# EAGLE design ESC-simple (EAGLE 8.5.2)
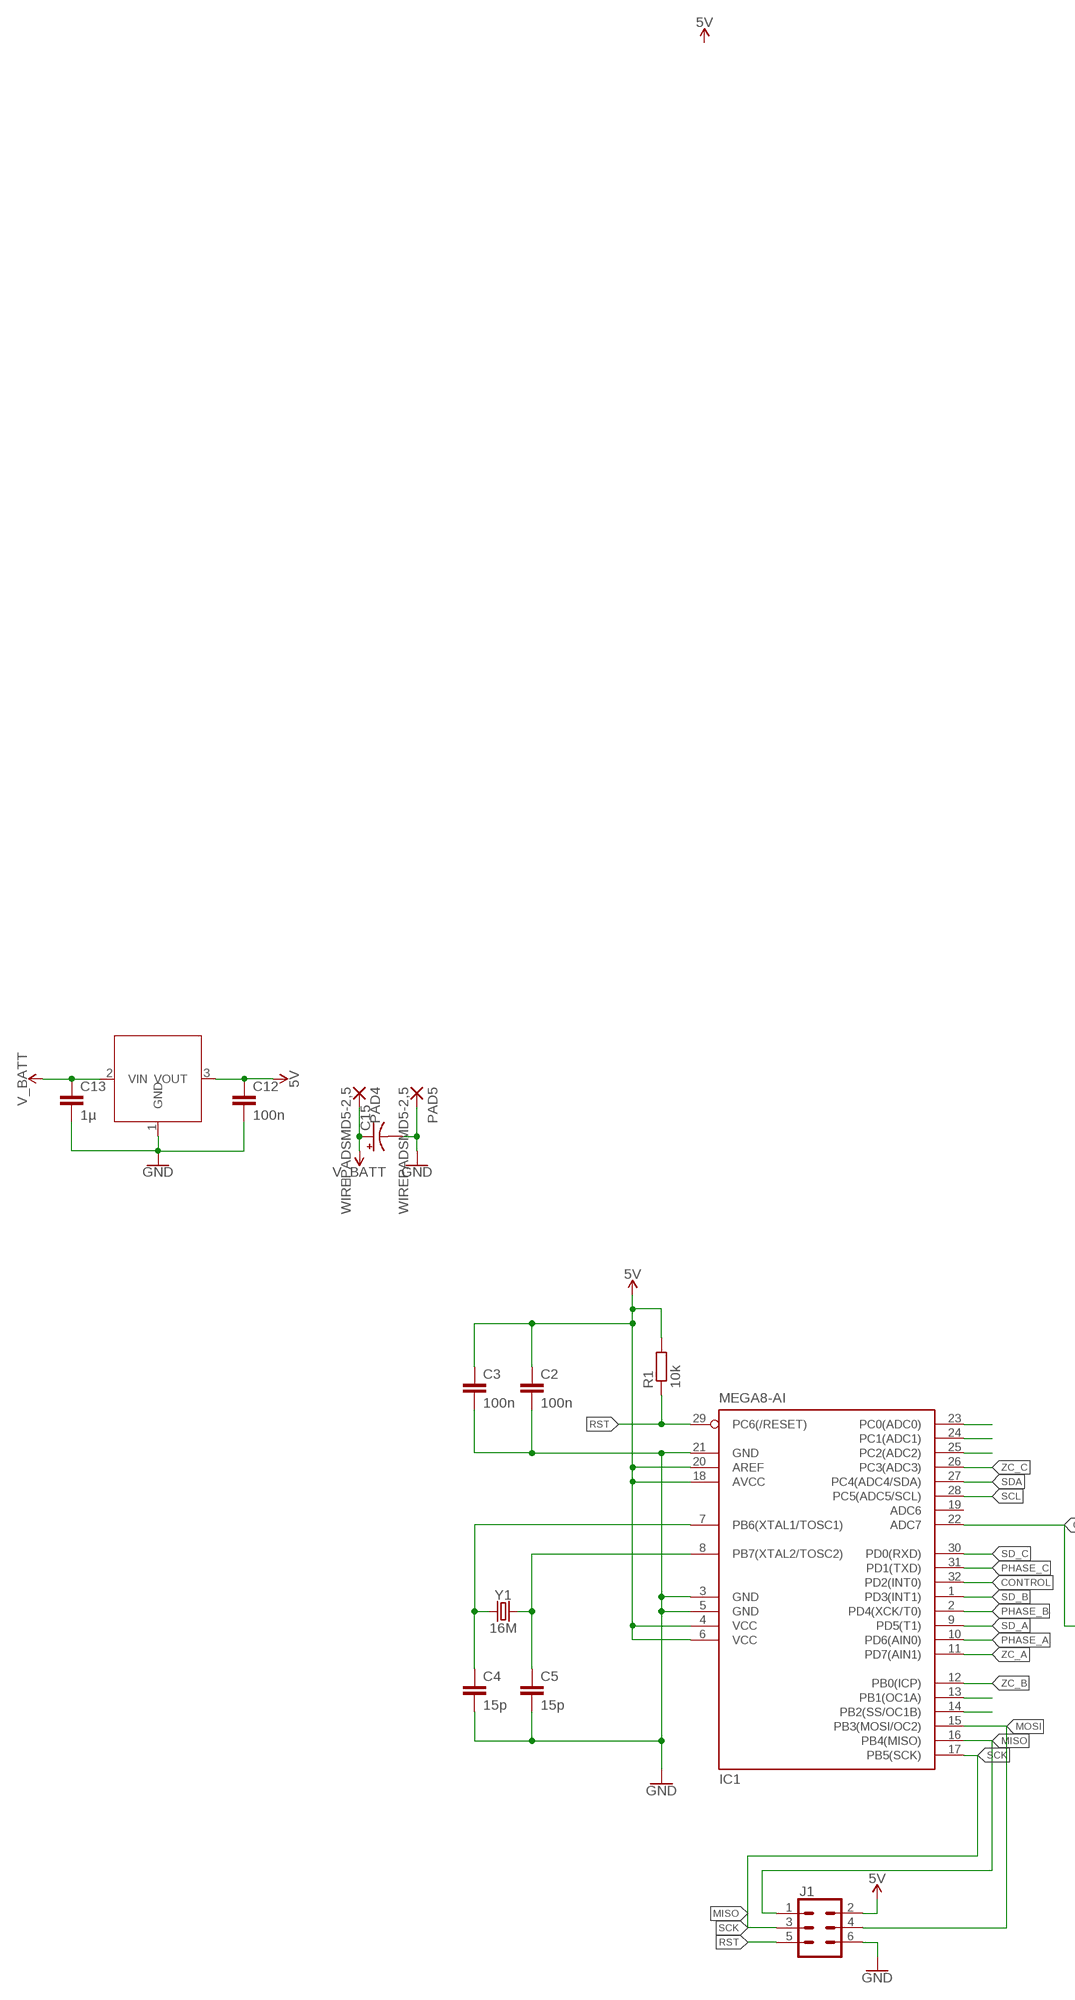
[diagram p0: schematic, sheet 1, part 1 of 2]
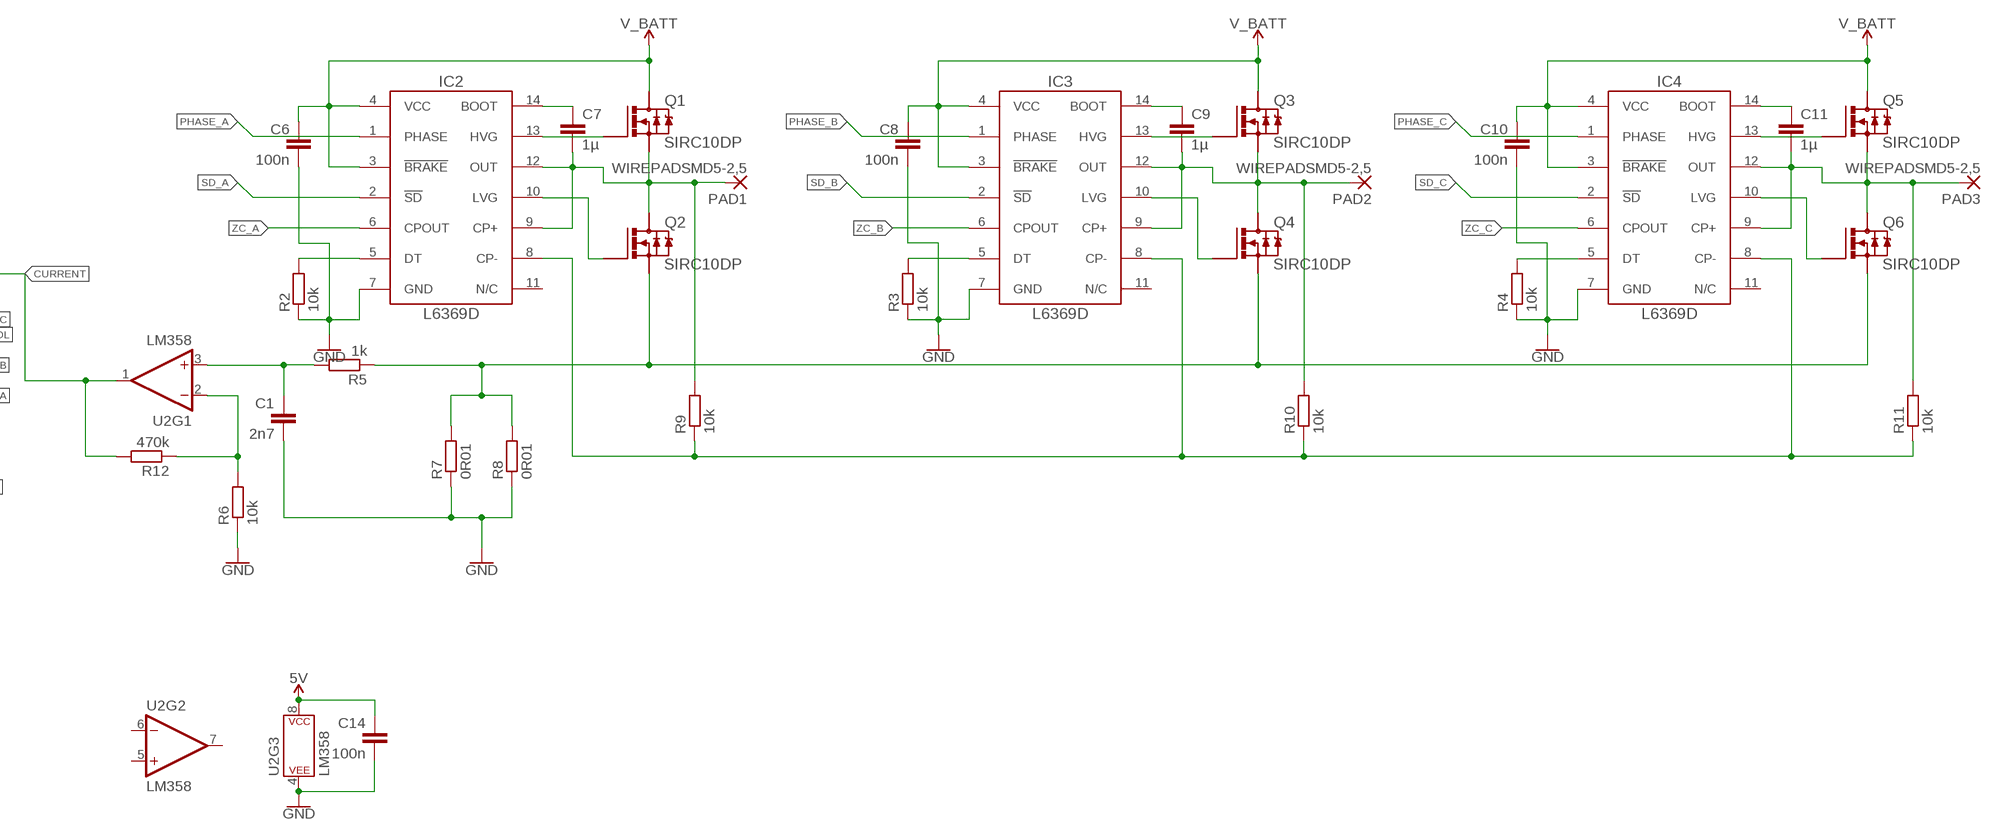
[diagram p1: schematic, sheet 1, part 2 of 2]

## Parts
C1  2n7  C-EUC1206K  [C1206K]
C2  100n  C-EUC1206K  [C1206K]
C3  100n  C-EUC1206K  [C1206K]
C4  15p  C-EUC1206K  [C1206K]
C5  15p  C-EUC1206K  [C1206K]
C6  100n  C-EUC1206K  [C1206K]
C7  1µ  C-EUC1206K  [C1206K]
C8  100n  C-EUC1206K  [C1206K]
C9  1µ  C-EUC1206K  [C1206K]
C10  100n  C-EUC1206K  [C1206K]
C11  1µ  C-EUC1206K  [C1206K]
C12  100n  C-EUC1206K  [C1206K]
C13  1µ  C-EUC1206K  [C1206K]
C14  100n  C-EUC1206K  [C1206K]
C15  CPOL-USE5-13  [E5-13]
IC1  MEGA8-AI  [TQFP32-08]
IC2  L6369D  [SO-14]
IC3  L6369D  [SO-14]
IC4  L6369D  [SO-14]
J1  CONN_03X22X3_SILK_MALE_PTH  [2X3]
PAD1  WIREPADSMD5-2,5  [5-2,5]
PAD2  WIREPADSMD5-2,5  [5-2,5]
PAD3  WIREPADSMD5-2,5  [5-2,5]
PAD4  WIREPADSMD5-2,5  [5-2,5]
PAD5  WIREPADSMD5-2,5  [5-2,5]
Q1  SIRC10DP  [POWERPAK_SO-8_SINGLE]
Q2  SIRC10DP  [POWERPAK_SO-8_SINGLE]
Q3  SIRC10DP  [POWERPAK_SO-8_SINGLE]
Q4  SIRC10DP  [POWERPAK_SO-8_SINGLE]
Q5  SIRC10DP  [POWERPAK_SO-8_SINGLE]
Q6  SIRC10DP  [POWERPAK_SO-8_SINGLE]
R1  10k  R-EU_R1206  [R1206]
R2  10k  R-EU_R1206  [R1206]
R3  10k  R-EU_R1206  [R1206]
R4  10k  R-EU_R1206  [R1206]
R5  1k  R-EU_R1206  [R1206]
R6  10k  R-EU_R1206  [R1206]
R7  0R01  R-EU_R1206  [R1206]
R8  0R01  R-EU_R1206  [R1206]
R9  10k  R-EU_R1206  [R1206]
R10  10k  R-EU_R1206  [R1206]
R11  10k  R-EU_R1206  [R1206]
R12  470k  R-EU_R1206  [R1206]
U2  LM358  [DIP08]
U$1  S812  [TO92L]
Y1  16M  CRYSTALSMD-HC49UP  [HC49UP]

## Nets
5V [power]: C2.1 C3.1 C12.1 C14.1 IC1.4(VCC) IC1.6(VCC) IC1.18(AVCC) IC1.20(AREF) J1.2 R1.2 U2.8(P$V+) U$1.3(VOUT)
A: C7.2 IC2.9(CP+) IC2.12(OUT) PAD1.1(P) Q1.1(S) Q1.2(S) Q1.3(S) Q2.5(D) Q2.6(D) Q2.7(D) Q2.8(D) Q2.9(D) R9.2
B: C9.2 IC3.9(CP+) IC3.12(OUT) PAD2.1(P) Q3.1(S) Q3.2(S) Q3.3(S) Q4.5(D) Q4.6(D) Q4.7(D) Q4.8(D) Q4.9(D) R10.2
C: C11.2 IC4.9(CP+) IC4.12(OUT) PAD3.1(P) Q5.1(S) Q5.2(S) Q5.3(S) Q6.5(D) Q6.6(D) Q6.7(D) Q6.8(D) Q6.9(D) R11.2
CONTROL: IC1.32(PD2(INT0))
CURRENT: IC1.22(ADC7) R12.2 U2.1(OUT)
CURRENT_SENSE: Q2.1(S) Q2.2(S) Q2.3(S) Q4.1(S) Q4.2(S) Q4.3(S) Q6.1(S) Q6.2(S) Q6.3(S) R5.1 R7.2 R8.2
GND: C1.2 C2.2 C3.2 C4.2 C5.2 C6.2 C8.2 C10.2 C12.2 C13.2 C14.2 C15.- IC1.3(GND) IC1.5(GND) IC1.21(GND) IC2.7(GND) IC3.7(GND) IC4.7(GND) J1.6 PAD5.1(P) R2.1 R3.1 R4.1 R6.1 R7.1 R8.1 U2.4(P$V-) U$1.1(GND)
MISO: IC1.16(PB4(MISO)) J1.1
MOSI: IC1.15(PB3(MOSI/OC2)) J1.4
N$1: C7.1 IC2.14(BOOT)
N$2: IC2.13(HVG) Q1.4(G)
N$3: IC2.10(LVG) Q2.4(G)
N$4: IC3.5(DT) R3.2
N$5: IC2.5(DT) R2.2
N$6: C9.1 IC3.14(BOOT)
N$7: IC3.13(HVG) Q3.4(G)
N$8: IC3.10(LVG) Q4.4(G)
N$9: R6.2 R12.1 U2.2(-IN)
N$10: IC4.5(DT) R4.2
N$11: C11.1 IC4.14(BOOT)
N$12: IC4.13(HVG) Q5.4(G)
N$13: IC4.10(LVG) Q6.4(G)
N$20: C1.1 R5.2 U2.3(+IN)
PB1: IC1.13(PB1(OC1A))
PB2: IC1.14(PB2(SS/OC1B))
PC0: IC1.23(PC0(ADC0))
PC1: IC1.24(PC1(ADC1))
PC2: IC1.25(PC2(ADC2))
PHASE_A: IC1.10(PD6(AIN0)) IC2.1(PHASE)
PHASE_B: IC1.2(PD4(XCK/T0)) IC3.1(PHASE)
PHASE_C: IC1.31(PD1(TXD)) IC4.1(PHASE)
RST: IC1.29(PC6(/RESET)) J1.5 R1.1
SCK: IC1.17(PB5(SCK)) J1.3
SCL: IC1.28(PC5(ADC5/SCL))
SD_A: IC1.9(PD5(T1)) IC2.2(!SD)
SD_B: IC1.1(PD3(INT1)) IC3.2(!SD)
SD_C: IC1.30(PD0(RXD)) IC4.2(!SD)
SDA: IC1.27(PC4(ADC4/SDA))
V_BATT [power]: C6.1 C8.1 C10.1 C13.1 C15.+ IC2.3(!BRAKE) IC2.4(VCC) IC3.3(!BRAKE) IC3.4(VCC) IC4.3(!BRAKE) IC4.4(VCC) PAD4.1(P) Q1.5(D) Q1.6(D) Q1.7(D) Q1.8(D) Q1.9(D) Q3.5(D) Q3.6(D) Q3.7(D) Q3.8(D) Q3.9(D) Q5.5(D) Q5.6(D) Q5.7(D) Q5.8(D) Q5.9(D) U$1.2(VIN)
V_NEUTRAL: IC2.8(CP-) IC3.8(CP-) IC4.8(CP-) R9.1 R10.1 R11.1
XTAL1: C4.1 IC1.7(PB6(XTAL1/TOSC1)) Y1.1
XTAL2: C5.1 IC1.8(PB7(XTAL2/TOSC2)) Y1.2
ZC_A: IC1.11(PD7(AIN1)) IC2.6(CPOUT)
ZC_B: IC1.12(PB0(ICP)) IC3.6(CPOUT)
ZC_C: IC1.26(PC3(ADC3)) IC4.6(CPOUT)
Unconnected: IC1.19(ADC6) IC2.11(N/C) IC3.11(N/C) IC4.11(N/C) U2.5(+IN) U2.6(-IN) U2.7(OUT)

## Library data of the parts
C1-C14 = rcl:C-EU: CAPACITOR, European symbol; SPICEPREFIX: C
C15 = rcl:CPOL-US: POLARIZED CAPACITOR, American symbol; SPICEPREFIX: C
IC1 = atmel:MEGA8: MICROCONTROLLER 8 Kbytes FLASH, 1 kbytes SRAM, 512 bytes EEPROM, USART, 6-channel 10 bit ADC, 2-channel 8 bit ADC Pin compatible with Atmega48, ATMega88, ATMega168 Source: avr.lbr; MPN: ATMEGA8-16AU; OC_FARNELL: 9171371; OC_NEWARK: 73M8863
IC2-IC4 = custom-ics:L6369
J1 = SparkFun-Connectors:CONN_03X2: Multi connection point. Often used as Generic Header-pin footprint for 0.1 inch spaced/style header connections You can populate with any combo of single row headers, but if you'd like an exact match, check these: Header - 2x3 (Male, 0.1") <https://www.sparkfun.com/products/12807> (PRT-12807) Header - 2x3 (Female, 0.1") <https://www.sparkfun.com/products/13010> (PRT-13010) 2x3 Pin Shrouded Header <https://www.sparkfun.com/products/10877> (PRT-10877) On any of the 0.1 inch spaced packages, you can populate with these: Break Away Headers - Straight <https://www.sparkfun.com/products/116> (PRT-00116) Break Away Male Headers - Right Angle <https://www.sparkfun.com/products/553> (PRT-00553) Female Headers <https://www.sparkfun.com/products/115> (PRT-00115) Break Away Headers - Machine Pin <https://www.sparkfun.com/products/117> (PRT-00117) Break Away Female Headers - Swiss Machine Pin <https://www.sparkfun.com/products/743> (PRT-00743) Special note: the shrouded connector mates well with our 3x2 ribbon cables: Ribbon Crimp Connector - 6-pin (2x3, Female) <https://www.sparkfun.com/products/10651> (PRT-10651) Ribbon Cable - 6 wire (15ft) <https://www.sparkfun.com/products/10646> (PRT-10646); PROD_ID: CONN-09701
PAD1-PAD5 = wirepad:WIREPAD: Wire PAD connect wire on PCB
Q1-Q6 = MOSFET:SIRC10DP: N-Channel 30 V (D-S) MOSFET with Schottky Diode Datasheet <https://www.vishay.com/docs/75189/sirc10dp.pdf>
R1-R12 = rcl:R-EU_: RESISTOR, European symbol; SPICEPREFIX: R
U2 = SparkFun-IC-Amplifiers:LM358: LM358 Jellybean op-amp Datasheet <http://www.sparkfun.com/datasheets/Components/General/LM358.pdf> SparkFun Products Op-Amp (Thru-Hole) - LM358 <https://www.sparkfun.com/products/9456> (COM-09456); PROD_ID: IC-09172
U$1 = untitled:S812
Y1 = SparkFun-Clocks:CRYSTAL: Crystals (Generic) These are passive quartz crystals, which can be used as a clock source for a microcontroller. Crystal's are two-terminal devices. They require external "load" capacitors to generate an oscillating signal.

## Net classes
0 default: width 0.305 mm, clearance 0.305 mm
1 power: width 0.305 mm, clearance 0.305 mm

## Board
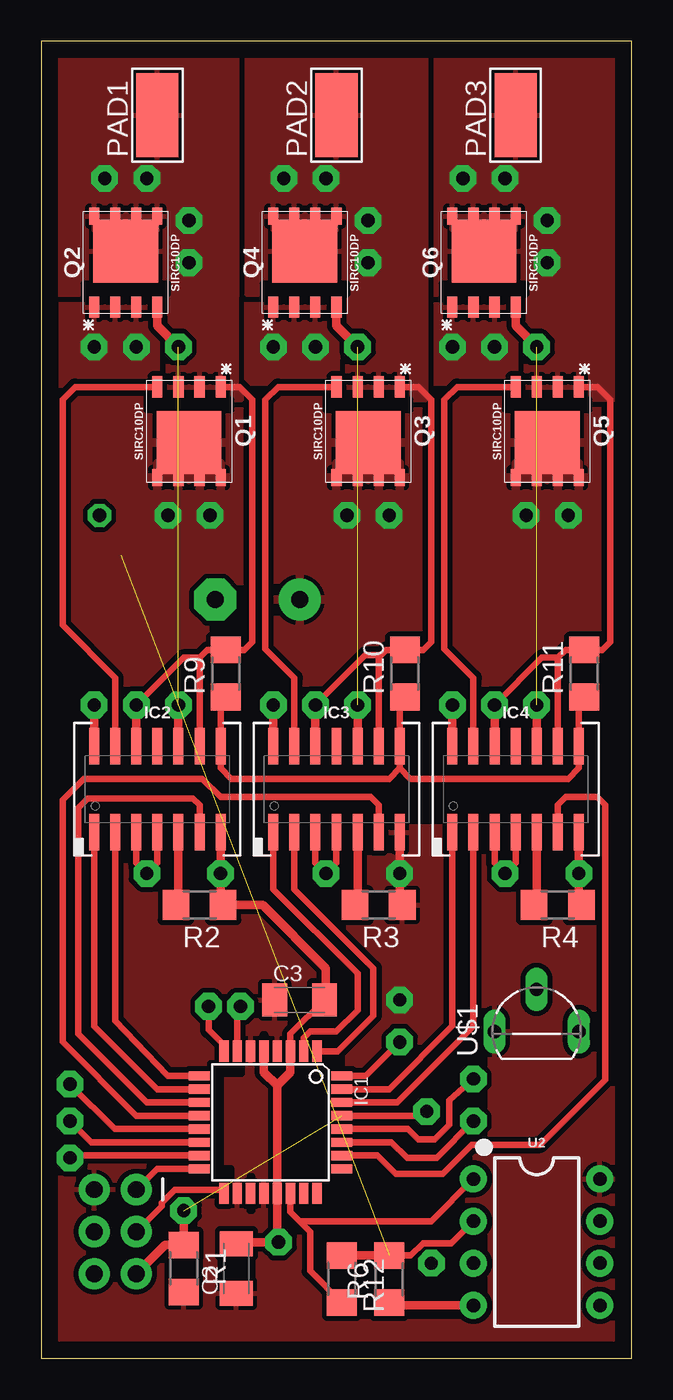
[diagram p2: board, top side]
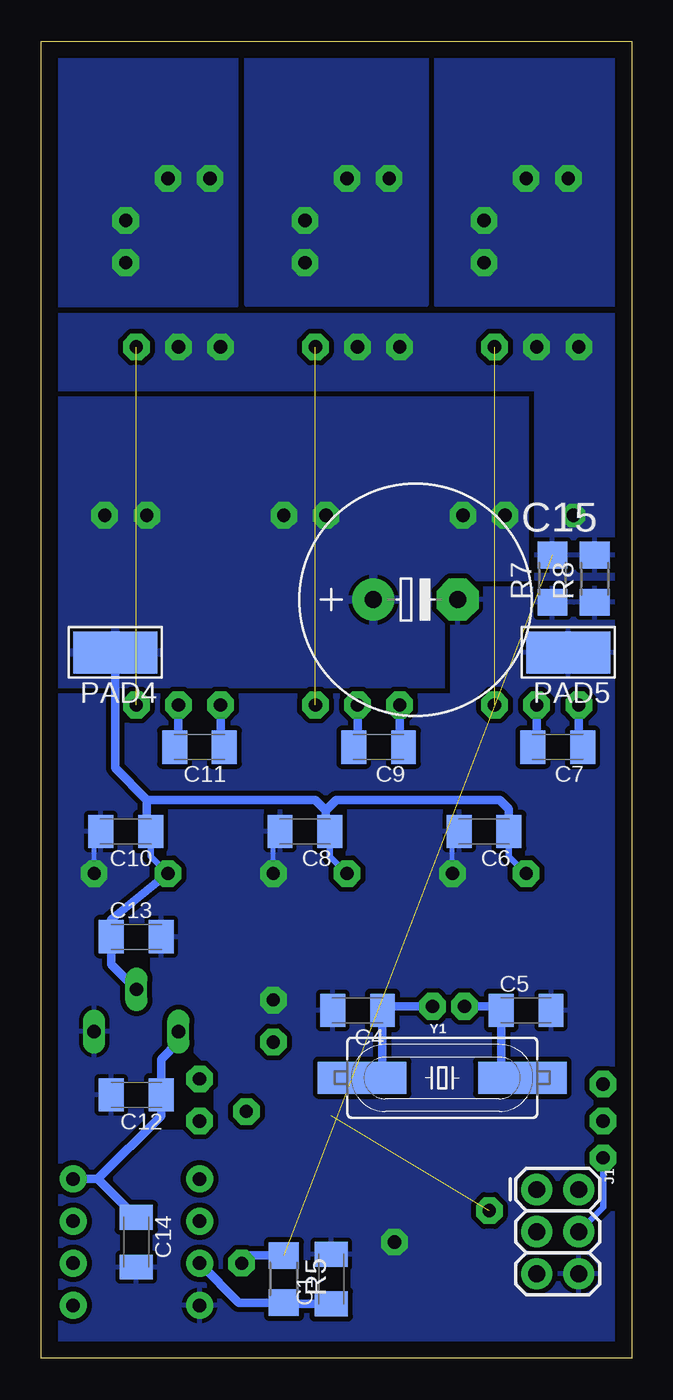
[diagram p3: board, bottom side, seen from below]

Size 35.56 x 79.38 mm. Coordinates in mm from the lower left corner, seen from the top.
Outline: 0,0 35.56,0 35.56,79.38 0,79.38 0,0
Copper layers (1*16): Top 0.035mm / dielectric 1.5mm / Bottom 0.035mm
Design rules "default": minimum track width 6mil, minimum drill 0.35mm, track to track 6mil, track to pad 6mil, pad to pad 6mil, via to via 6mil, smd to smd 6mil, copper to edge 40mil, drill to drill 6mil, minimum pad ring 10mil, minimum via ring 8mil, stop-mask expansion 4mil, vias tented up to drill 0mil, thermal gap 10mil
tRestrict: area 24.8,14 to 26.7,20.3; area 22.9,5.1 to 26.7,8.3; area 7.6,26.7 to 11.4,27.9; area 18.4,26.7 to 22.2,27.9; area 29.2,26.7 to 33,27.9; area 14,21 to 17.1,22.2; area 17.8,2.5 to 26.7,6.3; area 7.6,3.8 to 9.5,7; area 2.5,64.1 to 7.6,64.8; area 13.3,64.1 to 18.4,64.8; area 24.1,64.1 to 29.2,64.8; area 10.2,10.8 to 12.1,17.8; 9 more areas
bRestrict: area 2.5,36.2 to 6.4,37.5; area 13.3,36.2 to 17.1,37.5; area 24.1,36.2 to 27.9,37.5; area 7,31.1 to 10.8,32.4; area 17.8,31.1 to 21.6,32.4; area 28.6,31.1 to 32.4,32.4; area 27.9,24.8 to 31.8,26; area 29.2,23.5 to 31.1,24.8; area 27.9,15.2 to 31.8,16.5; area 14.6,20.3 to 18.4,21.6; area 4.4,20.3 to 8.3,21.6; area 17.1,3.2 to 20.3,5.7; 3 more areas

### Footprints (pad centres in the part's own frame; a part is rotated, then mirrored left to right if it is on the bottom)
C1206K = smd 1.5 x 2: 1 -1.5,0; 2 1.5,0
E5-13 = drill 1.016 pad 2.54: + -2.54,0 | drill 1.016 pad 2.54 octagon: - 2.54,0
TQFP32-08 = smd 1.27 x 0.559: 1 -4.293,2.8; 2 -4.293,2; 3 -4.293,1.2; 4 -4.293,0.4; 5 -4.293,-0.4; 6 -4.293,-1.2; 7 -4.293,-2; 8 -4.293,-2.8; 17 4.293,-2.8; 18 4.293,-2; 19 4.293,-1.2; 20 4.293,-0.4; 21 4.293,0.4; 22 4.293,1.2; 23 4.293,2; 24 4.293,2.8 | smd 0.559 x 1.27: 9 -2.8,-4.293; 10 -2,-4.293; 11 -1.2,-4.293; 12 -0.4,-4.293; 13 0.4,-4.293; 14 1.2,-4.293; 15 2,-4.293; 16 2.8,-4.293; 25 2.8,4.293; 26 2,4.293; 27 1.2,4.293; 28 0.4,4.293; 29 -0.4,4.293; 30 -1.2,4.293; 31 -2,4.293; 32 -2.8,4.293
SO-14 = smd 0.6 x 2.2: 1 -3.81,-2.6; 2 -2.54,-2.6; 3 -1.27,-2.6; 4 0,-2.6; 5 1.27,-2.6; 6 2.54,-2.6; 7 3.81,-2.6; 8 3.81,2.6; 9 2.54,2.6; 10 1.27,2.6; 11 0,2.6; 12 -1.27,2.6; 13 -2.54,2.6; 14 -3.81,2.6
2X3 = drill 1.016 pad 1.88: 1 0,0; 2 0,2.54; 3 2.54,0; 4 2.54,2.54; 5 5.08,0; 6 5.08,2.54
5-2,5 = smd 2.54 x 5.08: 1 0,0
POWERPAK_SO-8_SINGLE = smd 1.27 x 0.61: 1 -2.67,1.905; 2 -2.67,0.635; 3 -2.67,-0.635; 4 -2.67,-1.905 | smd 1.02 x 0.61: 5 2.795,-1.905; 6 2.795,-0.635; 7 2.795,0.635; 8 2.795,1.905 | smd 3.81 x 3.91: 9 0.69,0
R1206 = smd 1.6 x 1.803: 1 -1.422,0; 2 1.422,0
DIP08 = drill 0.813 pad 1.626: 1 -3.81,-3.81; 2 -1.27,-3.81; 3 1.27,-3.81; 4 3.81,-3.81; 5 3.81,3.81; 6 1.27,3.81; 7 -1.27,3.81; 8 -3.81,3.81
TO92L = drill 0.813 long: 1 0,-2.54; 2 2.54,0; 3 0,2.54
HC49UP = smd 5.334 x 1.93: 1 -4.826,0; 2 4.826,0

### Placement (x,y rotation side)
C1  18.1,4.76 90 bottom
C2  11.75,5.4 90 top
C3  15.56,21.59 0 top
C4  16.51,20.95 180 bottom
C5  6.35,20.95 0 bottom
C6  8.89,31.75 180 bottom
C7  4.45,36.83 180 bottom
C8  19.69,31.75 180 bottom
C9  15.24,36.83 180 bottom
C10  30.48,31.75 180 bottom
C11  26.04,36.83 180 bottom
C12  29.84,15.88 180 bottom
C13  29.84,25.4 0 bottom
C14  29.84,6.98 270 bottom
C15  13.02,45.72 0 bottom
IC1  13.81,14.21 270 top
IC2  6.99,34.29 0 top
IC3  17.78,34.29 0 top
IC4  28.58,34.29 0 top
J1  5.72,10.16 270 bottom
PAD1  6.99,74.93 0 top
PAD2  17.78,74.93 0 top
PAD3  28.58,74.93 0 top
PAD4  31.12,42.55 90 bottom
PAD5  3.81,42.55 90 bottom
Q1  8.89,55.88 270 top
Q2  5.08,66.04 90 top
Q3  19.69,55.88 270 top
Q4  15.88,66.04 90 top
Q5  30.48,55.88 270 top
Q6  26.67,66.04 90 top
R1  8.57,5.4 270 top
R2  9.53,27.3 180 top
R3  20.32,27.3 180 top
R4  31.12,27.3 180 top
R5  20.96,4.76 270 bottom
R6  20.96,4.76 90 top
R7  4.76,46.99 90 bottom
R8  2.22,46.99 90 bottom
R9  11.11,41.28 90 top
R10  21.91,41.28 90 top
R11  32.7,41.28 90 top
R12  18.1,4.76 270 top
U2  29.84,6.98 270 top
U$1  29.84,19.68 90 top
Y1  11.41,16.9 0 bottom

### Tracks (layer width: path | path; a pad name or v marks a point on that pad's centre or on a via)
5V
  Bottom 0.508: C14.1 32.16,10.79 | 32.16,10.79 U2.8 | 32.16,10.79 28.34,14.61 C12.1 28.34,18.01 27.3,19.05 U$1.3
  pour Top (rank 4): 36.2,34.29 -0.63,34.29 -0.63,-0.64 36.2,-0.64
A  (via drill 0.8 pad 1.6)
  Top 0.305: Q2.8 3.18,68.63
  Top 0.406: Q1.1 11.94,58.55 12.7,57.79 12.7,43.18 12.22,42.7 R9.2 10,42.7 9.53,42.23 | IC2.9 9.53,42.23 | 9.53,42.23 8.57,42.23 v5.72,39.37
  Top 0.508: v5.72,39.37 IC2.12
  Bottom 0.305: 5.72,37.15 C7.2
  Bottom 0.508: v5.72,39.37 5.72,37.15
  other vias: 3.81,71.12 6.35,71.12 8.89,68.58 8.89,66.04
  pour Top (rank 3): -0.63,64.14 12.7,64.14 12.7,80.01 -0.63,80.01
  pour Top (rank 3): 7.62,69.85 7.62,57.79 12.07,57.79 12.07,69.85
  pour Bottom (rank 2): 11.75,63.5 11.75,80.01 -0.63,80.01 -0.63,63.5
B  (via drill 0.8 pad 1.6)
  Top 0.305: Q4.8 13.97,68.63
  Top 0.406: Q3.1 22.73,58.55 23.5,57.79 23.5,43.18 23.01,42.7 R10.2 20.79,42.7 20.48,42.39 | IC3.9 20.32,42.23 20.48,42.39 | 20.48,42.39 19.53,42.39 v16.51,39.37
  Top 0.508: IC3.12 v16.51,39.37
  Bottom 0.305: 16.51,37.15 C9.2
  Bottom 0.508: v16.51,39.37 16.51,37.15
  other vias: 14.61,71.12 17.14,71.12 19.69,68.58 19.69,66.04
  pour Top: 18.42,57.79 23.18,57.79 23.18,80.01 12.38,80.01 12.38,64.14 18.42,64.14
  pour Bottom: 12.38,80.01 12.38,63.5 23.18,63.5 23.18,80.01
C  (via drill 0.8 pad 1.6)
  Top 0.406: Q5.1 33.52,58.55 34.29,57.79 34.29,43.18 33.81,42.7 R11.2 31.59,42.7 31.12,42.23 | IC4.9 31.12,42.23 | 31.12,42.23 30.16,42.23 v27.3,39.37
  Top 0.508: IC4.12 v27.3,39.37
  Bottom 0.305: 27.3,37.15 C11.2
  Bottom 0.508: v27.3,39.37 27.3,37.15
  other vias: 25.4,71.12 27.94,71.12 30.48,68.58 30.48,66.04
  pour Top (rank 3): 22.23,80.01 22.23,64.14 36.2,64.14 36.2,80.01
  pour Top: 29.21,57.79 29.21,69.85 36.83,69.85 36.83,57.79
  pour Bottom (rank 2): 23.81,63.5 23.81,80.01 36.83,80.01 36.83,63.5
CONTROL  (via drill 0.8 pad 1.6)
  Top 0.406: IC1.32 19.55,17.01 v21.59,19.05
CURRENT
  Top 0.406: IC1.22 15.01,8.81 15.56,8.26 | 15.56,8.26 23.5,8.26 U2.1 | 15.56,8.26 16.19,7.62 16.19,5.25 R12.2
CURRENT_SENSE  (via drill 0.8 pad 1.4, 0.8 pad 1.6)  (1 unrouted)
  Bottom 0.508: R5.1 23.03,6.19 v23.5,5.71
  other vias: 5.72,60.96 16.51,60.96 27.3,60.96 3.18,60.96 13.97,60.96 24.77,60.96 3.49,50.8
  pour Bottom (rank 3): 40.64,58.42 40.64,62.87 -4.45,62.87 -4.45,46.99 5.72,46.99 5.72,58.42
  pour Top (rank 2): 12.38,64.14 18.42,64.14 18.42,58.74 12.38,58.74
  pour Top (rank 4): 0.64,64.14 6.99,64.14 6.99,57.79 0.64,57.79
  pour Top (rank 2): 22.86,63.5 28.58,63.5 28.58,58.74 22.86,58.74
GND  (via drill 0.8 pad 1.6)
  Top 0.305: R2.1 10.8,27.62 | R3.1 21.59,27.62 | 32.39,27.62 R4.1 | R6.1 21.11,3.17 | 14.21,6.9 v14.29,6.98 | C2.2 11.52,6.98
  Top 0.406: C3.2 15.01,19.54 IC1.3
  Top 0.508: IC2.7 v10.8,29.21 10.8,27.62 | IC3.7 v21.59,29.21 21.59,27.62 | IC4.7 v32.39,29.21 32.39,27.62 | 21.11,3.17 U2.4 | 14.21,6.9 IC1.21 14.21,16.43 | 11.52,6.98 v14.29,6.98 | IC1.3 15.01,17.23 14.21,16.43 | 14.21,16.43 13.41,17.23 IC1.5 | R2.1 13.34,27.3 17.14,23.5 17.14,21.68 C3.2
  Bottom 0.305: v10.8,29.21 10.8,30.79 C6.2 | v21.59,29.21 21.59,30.79 C8.2 | v32.39,29.21 32.39,30.79 C10.2
  Bottom 0.508: 4.13,42.23 PAD5.1
  other vias: 21.59,21.59
  pour Bottom (rank 6): -34.92,80.64 -34.92,-1.27 69.22,-1.27 69.22,80.64
  pour Bottom: -1.27,46.36 10.8,46.36 10.8,39.37 -1.27,39.37
  pour Top: 18.42,15.24 21.59,15.24 26.04,19.68 26.04,31.11 27.3,32.38 31.12,32.38 32.39,33.66 32.39,34.93 31.75,35.56 16.51,35.56 18.42,34.93
MISO
  Top 0.305: IC1.16 9.49,11.43
  Top 0.406: IC1.16 6.97,11.41 J1.1
MOSI  (via drill 0.8 pad 1.6)
  Top 0.406: IC1.15 1.86,12.21 v1.72,12.06
  Bottom 0.406: v1.72,12.06 1.72,9.08 J1.4
N$1  (via drill 0.8 pad 1.6)
  Top 0.508: IC2.14 v3.18,39.37
  Bottom 0.305: 3.18,37.15 C7.1
  Bottom 0.508: v3.18,39.37 3.18,37.15
N$2
  Top 0.406: Q1.4 2.04,58.55 1.27,57.79 1.27,44.18 4.45,41.01 IC2.13
N$3  (via drill 0.8 pad 1.6)  (1 unrouted)
  Top 0.508: IC2.10 v8.26,39.37 | Q2.4 6.99,62.23 v8.26,60.96
N$4
  Top 0.305: 19.05,27.62 R3.2
  Top 0.508: IC3.5 19.05,27.62
N$5
  Top 0.305: R2.2 8.26,27.62
  Top 0.508: 8.26,27.62 IC2.5
N$6  (via drill 0.8 pad 1.6)
  Top 0.508: IC3.14 v13.97,39.37
  Bottom 0.305: 13.97,37.15 C9.1
  Bottom 0.508: v13.97,39.37 13.97,37.15
N$7
  Top 0.406: Q3.4 14.26,58.55 13.49,57.79 13.49,42.75 15.24,41.01 IC3.13
N$8  (via drill 0.8 pad 1.6)  (1 unrouted)
  Top 0.508: IC3.10 v19.05,39.37 | Q4.4 17.78,62.23 v19.05,60.96
N$9
  Top 0.406: R6.2 22.26,6.19 23,6.92 24.7,6.92 U2.2
  Top 0.508: R12.1 R6.2
N$10
  Top 0.305: 29.84,27.62 R4.2
  Top 0.508: IC4.5 29.84,27.62
N$11  (via drill 0.8 pad 1.6)
  Top 0.508: IC4.14 v24.77,39.37
  Bottom 0.305: 24.77,37.15 C11.1
  Bottom 0.508: v24.77,39.37 24.77,37.15
N$12
  Top 0.406: Q5.4 25.05,58.55 24.29,57.79 24.29,42.75 26.04,41.01 IC4.13
N$13  (via drill 0.8 pad 1.6)  (1 unrouted)
  Top 0.508: IC4.10 v29.84,39.37 | Q6.4 28.58,62.23 v29.84,60.96
N$20
  Bottom 0.305: 20.88,3.26 R5.2
  Bottom 0.508: C1.1 20.88,3.26 | R5.2 23.66,3.34 U2.3
PB1  (via drill 0.8 pad 1.6)
  Top 0.406: IC1.13 4.42,13.81 v1.72,16.51
PB2  (via drill 0.8 pad 1.6)
  Top 0.406: IC1.14 2.99,13.01 v1.72,14.29
PHASE_A
  Top 0.406: IC1.10 6.97,16.21 3.18,20 IC2.1
PHASE_B
  Top 0.406: IC1.2 15.81,19.3 16.19,19.68 17.78,19.68 19.05,20.95 19.05,23.18 13.97,28.26 IC3.1
PHASE_C
  Top 0.406: IC4.1 24.77,20.02 20.96,16.21 IC1.31
RST  (via drill 0.8 pad 1.6)  (1 unrouted)
  Top 0.406: IC1.29 22.84,14.61 v23.21,14.87
  Top 0.508: v8.57,8.89 R1.1 7.46,6.82 J1.5
SCK
  Top 0.305: 10.76,10.16 10.78,10.14 IC1.17
  Top 0.406: J1.3 7.26,9.16 7.26,9.37 8.03,10.14 10.78,10.14
SCL  (via drill 0.8 pad 1.6)
  Top 0.406: v26.04,16.83 24.58,15.53 24.58,14.05 23.71,13.19 22.71,13.19 22.09,13.81 IC1.28
SD_A
  Top 0.406: IC1.9 7.6,17.01 4.45,20.32 IC2.2
SD_B
  Top 0.406: IC3.2 15.24,28.26 20,23.5 20,20.64 17.87,18.5 IC1.1
SD_C
  Top 0.406: IC1.30 21.44,15.41 26.04,20 IC4.2
SDA  (via drill 0.8 pad 1.6)
  Top 0.406: IC1.27 21.09,13.01 22.03,12.06 23.81,12.06 v26.04,14.29
V_BATT  (via drill 0.8 pad 1.6)
  Top 0.406: IC2.4 6.99,29.84 v6.35,29.21 5.72,29.84 IC2.3 | IC3.3 16.51,29.84 v17.14,29.21 17.78,29.84 IC3.4 | IC4.3 27.3,29.84 v27.94,29.21 28.58,29.84 IC4.4
  Bottom 0.406: C6.1 7.39,30.25 v6.35,29.21 | C8.1 18.19,30.25 v17.14,29.21 | C10.1 28.98,30.25 v27.94,29.21
  Bottom 0.508: PAD4.1 31.12,35.56 29.21,33.66 | 18.42,33.02 19.05,33.66 29.21,33.66 | 18.42,33.02 17.79,33.66 7.94,33.66 7.39,33.11 C6.1 | U$1.2 31.34,23.72 C13.1 31.34,26.44 v27.94,29.21 | C10.1 29.21,31.98 29.21,33.66 | 18.42,33.02 18.42,31.98 C8.1
  other vias: 7.62,50.8 10.16,50.8 18.42,50.8 20.96,50.8 29.21,50.8 31.75,50.8
  pour Bottom (rank 4): 5.72,57.79 40.01,57.79 40.01,40.64 5.72,40.64
  pour Top (rank 4): 41.91,57.79 -6.35,57.79 -6.35,36.83 41.91,36.83
V_NEUTRAL
  Top 0.305: 32.39,39.54 R11.1 | 10.8,39.54 R9.1 | 21.59,39.54 R10.1
  Top 0.406: 21.59,35.56 20.96,34.93 11.43,34.93 10.8,35.56 IC2.8 10.8,39.54 | 21.59,35.56 IC3.8 21.59,39.54 | 21.59,35.56 22.23,34.93 31.75,34.93 32.39,35.56 IC4.8 32.39,39.54
XTAL1  (via drill 0.8 pad 1.6)
  Top 0.406: IC1.7 11.81,21.01 v11.99,21.2
  Bottom 0.508: v11.99,21.2 14.77,21.2 C4.1 15.01,17.38 15.49,16.9 Y1.1
XTAL2  (via drill 0.8 pad 1.6)
  Top 0.406: IC1.8 11.01,18.84 10.07,19.77 v10.07,21.2
  Bottom 0.508: v10.07,21.2 8.1,21.2 C5.1 7.85,17.38 7.38,16.9 Y1.2
ZC_A
  Top 0.406: IC2.6 9.53,33.34 9.13,33.74 2.79,33.74 2.22,33.17 2.22,19.54 6.35,15.41 IC1.11
ZC_B
  Top 0.406: IC3.6 20.32,33.34 19.84,33.81 10.8,33.81 9.68,34.93 2.54,34.93 1.27,33.66 1.27,19.05 5.71,14.61 IC1.12
ZC_C
  Top 0.406: IC4.6 31.12,33.34 31.59,33.81 33.5,33.81 33.97,33.34 33.97,16.78 30.05,12.86 25.92,12.86 24.18,11.11 21.35,11.11 20.25,12.21 IC1.26